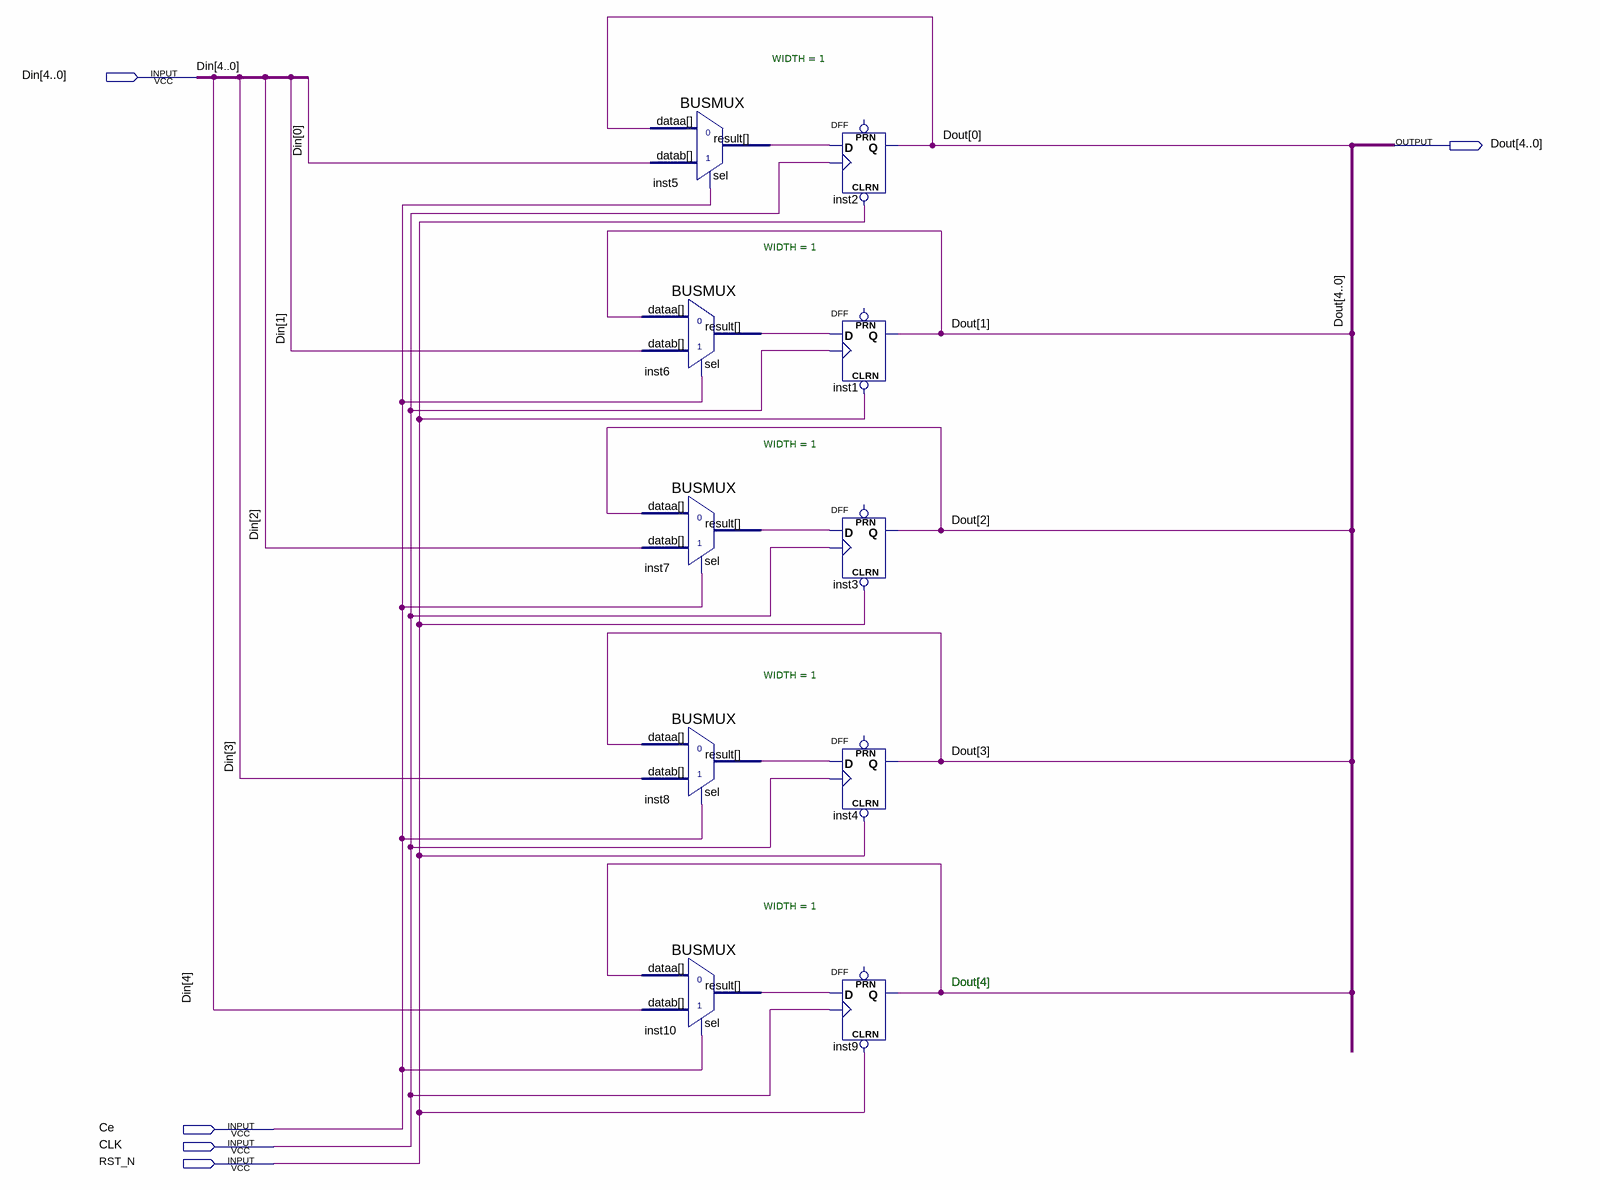
[diagram p0: schematic sheet]
// Quartus schematic register5.bdf as structural Verilog: 10 symbols, 5 pins
module register5 (
  input  [4:0] Din,
  input  Ce,
  input  CLK,
  input  RST_N,
  output [4:0] Dout
);

  wire inst5_result, inst6_result, inst7_result, inst8_result, inst10_result;

  BUSMUX #(.WIDTH(1)) inst5 (.datab(Din[0]), .sel(Ce), .dataa(Dout[0]), .result(inst5_result));
  BUSMUX #(.WIDTH(1)) inst6 (.datab(Din[1]), .sel(Ce), .dataa(Dout[1]), .result(inst6_result));
  BUSMUX #(.WIDTH(1)) inst7 (.datab(Din[2]), .sel(Ce), .dataa(Dout[2]), .result(inst7_result));
  BUSMUX #(.WIDTH(1)) inst8 (.datab(Din[3]), .sel(Ce), .dataa(Dout[3]), .result(inst8_result));
  BUSMUX #(.WIDTH(1)) inst10 (.datab(Din[4]), .sel(Ce), .dataa(Dout[4]), .result(inst10_result));
  DFF inst2 (.CLRN(RST_N), .CLK(CLK), .D(inst5_result), .Q(Dout[0]));  // open: PRN
  DFF inst1 (.CLRN(RST_N), .CLK(CLK), .D(inst6_result), .Q(Dout[1]));  // open: PRN
  DFF inst3 (.CLRN(RST_N), .CLK(CLK), .D(inst7_result), .Q(Dout[2]));  // open: PRN
  DFF inst4 (.CLRN(RST_N), .CLK(CLK), .D(inst8_result), .Q(Dout[3]));  // open: PRN
  DFF inst9 (.CLRN(RST_N), .CLK(CLK), .D(inst10_result), .Q(Dout[4]));  // open: PRN

  // Notes on the sheet:
  //   Dout[4]
endmodule
